# Altium schematic sheet Sheet4.SchDoc
size A4; SheetNumber: 2; SheetTotal: 2
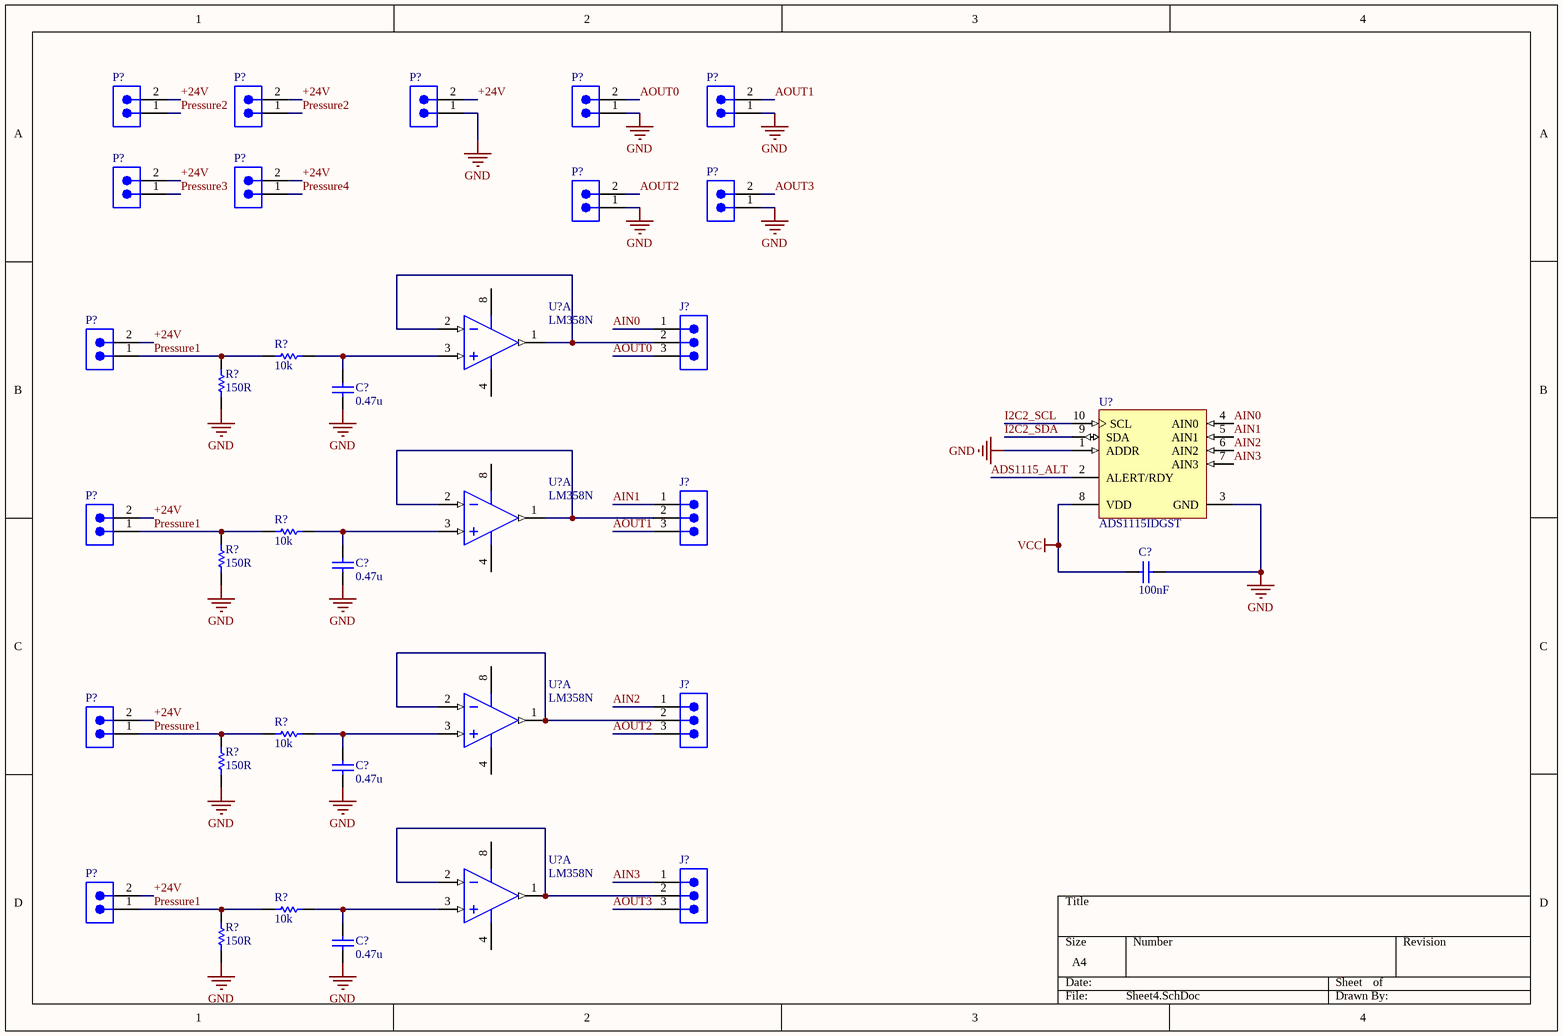
[diagram p0: Sheet4.SchDoc]

## Parts
(Parts that share a designator on the sheet are numbered #1, #2 ... from top to bottom, then left to right.)
C?#1  value 0.47u  (hidden comment: Capacitor)
C?#2  value 100nF  (hidden comment: Capacitor)
C?#3  value 0.47u  (hidden comment: Capacitor)
C?#4  value 0.47u  (hidden comment: Capacitor)
C?#5  value 0.47u  (hidden comment: Capacitor)
J?#1  (no value)  [679303124022]
J?#2  (no value)  [679303124022]
J?#3  (no value)  [679303124022]
J?#4  (no value)  [679303124022]
P?#1  (no value)  [620302124022]
P?#2  (no value)  [620302124022]
P?#3  (no value)  [620302124022]
P?#4  (no value)  [620302124022]
P?#5  (no value)  [620302124022]
P?#6  (no value)  [620302124022]
P?#7  (no value)  [620302124022]
P?#8  (no value)  [620302124022]
P?#9  (no value)  [620302124022]
P?#10  (no value)  [620302124022]
P?#11  (no value)  [620302124022]
P?#12  (no value)  [620302124022]
P?#13  (no value)  [620302124022]
R?#1  value 10k  (hidden comment: Resistor)
R?#2  value 150R  (hidden comment: Resistor)
R?#3  value 10k  (hidden comment: Resistor)
R?#4  value 150R  (hidden comment: Resistor)
R?#5  value 10k  (hidden comment: Resistor)
R?#6  value 150R  (hidden comment: Resistor)
R?#7  value 10k  (hidden comment: Resistor)
R?#8  value 150R  (hidden comment: Resistor)
U?#1  LM358N  [ONSC-PDIP-8-626-05_M]  (part A of 2)
U?#2  ADS1115IDGST  [TI-DGS10_M]
U?#3  LM358N  [ONSC-PDIP-8-626-05_M]  (part A of 2)
U?#4  LM358N  [ONSC-PDIP-8-626-05_M]  (part A of 2)
U?#5  LM358N  [ONSC-PDIP-8-626-05_M]  (part A of 2)

## Nets
GND: C?#1.1 C?#2.1 C?#3.1 C?#4.1 C?#5.1 P?#3.1 P?#4.1 P?#5.1 P?#8.1 P?#9.1 R?#2.1 R?#4.1 R?#6.1 R?#8.1 U?#2.1(ADDR) U?#2.3(GND)
VCC: C?#2.2 U?#2.8(VDD)
+24V: P?#1.2 P?#2.2 P?#3.2 P?#6.2 P?#7.2 P?#10.2 P?#11.2 P?#12.2 P?#13.2
ADS1115_ALT: U?#2.2(ALERT/RDY)
AIN0: J?#1.1 U?#2.4(AIN0)
AIN1: J?#2.1 U?#2.5(AIN1)
AIN2: J?#3.1 U?#2.6(AIN2)
AIN3: J?#4.1 U?#2.7(AIN3)
AOUT0: J?#1.3 P?#4.2
AOUT1: J?#2.3 P?#5.2
AOUT2: J?#3.3 P?#8.2
AOUT3: J?#4.3 P?#9.2
I2C2_SCL: U?#2.10(SCL)
I2C2_SDA: U?#2.9(SDA)
Pressure1: P?#10.1 P?#11.1 P?#12.1 P?#13.1 R?#1.2 R?#2.2 R?#3.2 R?#4.2 R?#5.2 R?#6.2 R?#7.2 R?#8.2
Pressure2: P?#1.1 P?#2.1
Pressure3: P?#6.1
Pressure4: P?#7.1
NetC?#1_2: C?#1.2 R?#1.1 U?#1.3(INA+)
NetC?#3_2: C?#3.2 R?#3.1 U?#3.3(INA+)
NetC?#4_2: C?#4.2 R?#5.1 U?#4.3(INA+)
NetC?#5_2: C?#5.2 R?#7.1 U?#5.3(INA+)
NetJ?#1_2: J?#1.2 U?#1.1(OUTA) U?#1.2(INA-)
NetJ?#2_2: J?#2.2 U?#3.1(OUTA) U?#3.2(INA-)
NetJ?#3_2: J?#3.2 U?#4.1(OUTA) U?#4.2(INA-)
NetJ?#4_2: J?#4.2 U?#5.1(OUTA) U?#5.2(INA-)

Not connected (* = marked no-connect by the designer): U?#1 4(VEE/GND) 8(VCC); U?#3 4(VEE/GND) 8(VCC); U?#4 4(VEE/GND) 8(VCC); U?#5 4(VEE/GND) 8(VCC)

## Library data of the parts
C?#1-C?#5 = Capacitor: SimulationGenericComponent: True
J?#1-J?#4 = CMP-1502-00722-2: NexarPartId: 18818282; Insulation: Insulated; Operating Supply Voltage: 50V; Number of Contacts: 3; Current Rating: 1A; Insulation Resistance: 100MΩ; Gender: Male; Contact Resistance: 20mΩ; Connector Type: Male Pin; Pitch: 1.5mm; Number of Pins: 3; Flammability Rating: UL94 V-0; Lead Pitch: 1.5mm; Max Operating Temperature: 85°C; Contact Plating: Tin; Contact Gender: Male; Height: 5mm; Contact Material: Copper; Mount: Surface Mount; Termination: SMD/SMT; Number of Positions: 3; Color: Beige, White; Length: 7.5mm; Voltage Rating: 50V; Packaging: Tape and Reel; RoHS: Compliant; Housing Material: Nylon; Width: 7.5mm; Number of Rows: 1; Orientation: Vertical; REACH SVHC: No SVHC; Min Operating Temperature: -25°C
P?#1-P?#13 = CMP-1502-00660-2: NexarPartId: 18818242; Insulation: Insulated; Connector Type: Male Pin; Pitch: 2mm; Insulation Resistance: 1GΩ; Gender: Male; Voltage Rating: 125V; Number of Positions: 2; Contact Resistance: 20mΩ; Operating Supply Voltage: 100V; Current Rating: 2A; Contact Material: Copper; Number of Rows: 1; Flammability Rating: UL94 V-0; Housing Material: Nylon; Lead Pitch: 2mm; Orientation: Vertical; Max Operating Temperature: 85°C; Termination: SMD/SMT; REACH SVHC: Unknown; Contact Mating Length: 3.5052mm; RoHS: Compliant; Packaging: Tape and Reel; Number of Contacts: 2; Height: 6.6mm; Mount: Surface Mount; Number of Pins: 2; Contact Gender: Male; Min Operating Temperature: -40°C; Length: 5mm; Width: 7.9mm; Contact Plating: Tin; Color: Beige, White
R?#1-R?#8 = Resistor: TC1: 0; SimulationGenericComponent: True; TC2: 0
U?#1 U?#3-U?#5 = CMP-1310-00098-1: Single Supply Dual Operational Amplifier, 3 to 32 V, 0 to 70 degC, 8-Pin PDIP, Tube; Manufacturer: On Semiconductor; VCC Max (V): 32; VCC Min (V): 3; Mounting Technology: Through Hole; ComponentLink3Description: Package Specification; ComponentLink3URL: http://www.onsemi.com/pub_link/Collateral/LM211-D.PDF; RoHS: FALSE; Packing: Tube; PackageDescription: 8-Pin Plastic Dual-In Line Package, Body 9.52 x 6.605 mm, Pitch 2.54 mm; PackageReference: PDIP-8-626-05; PackageVersion: Rev. M, 04/2010; PartNumber: LM358N; ComponentLink2Description: Datasheet; ComponentLink2URL: http://www.onsemi.cn/pub_link/Collateral/LM358-D.PDF; ComponentLink1URL: http://www.onsemi.com/; ComponentLink1Description: Manufacturer URL; DatasheetVersion: Rev. 27
U?#2 = CMP-0003-00378-2: 16-Bit ADC with Integrated Multiplexer, PGA, Comparator, Oscillator, and Reference, -40 to 125 degC, 10-pin SOP (DGS10), Green (RoHS & no Sb/Br); Manufacturer: Texas Instruments; Sample Rate (max)(SPS): 860; SubFamily: Precision ADC (<=10MSPS); Architecture: Delta-Sigma; Digital Supply(Min)(V): 2; Resolution(Bits): 16; Digital Supply(Max)(V): 5.5; INL(Max)(+/-LSB): 1; Interface: Serial I2C; # Input Channels: 4; Eco-Plan: Green (RoHS & no Sb/Br); PackageDescription: 10-Pin Plastic Small Outline, Body 3 x 3 mm, Pitch 0.5 mm; Mounting Technology: Surface Mount; PackageReference: DGS10; DatasheetVersion: SBAS444B; ComponentLink3Description: Package Specification; ComponentLink1Description: Manufacturer URL; PartNumber: ADS1115IDGST; ComponentLink3URL: http://www.ti.com/lit/ml/mpds035b/mpds035b.pdf; ComponentLink2URL: http://www.ti.com/general/docs/lit/getliterature.tsp?genericPartNumber=ADS1115&fileType=pdf; Analog Voltage AV/DD(Min)(V): 2; ComponentLink2Description: Datasheet; PackageVersion: 4073272/C, 02/2004; Analog Voltage AV/DD(Max)(V): 5.5; Code_JEDEC: MO-153; ComponentLink1URL: http://www.ti.com/